# EAGLE design Teststand (EAGLE 8.5.2)
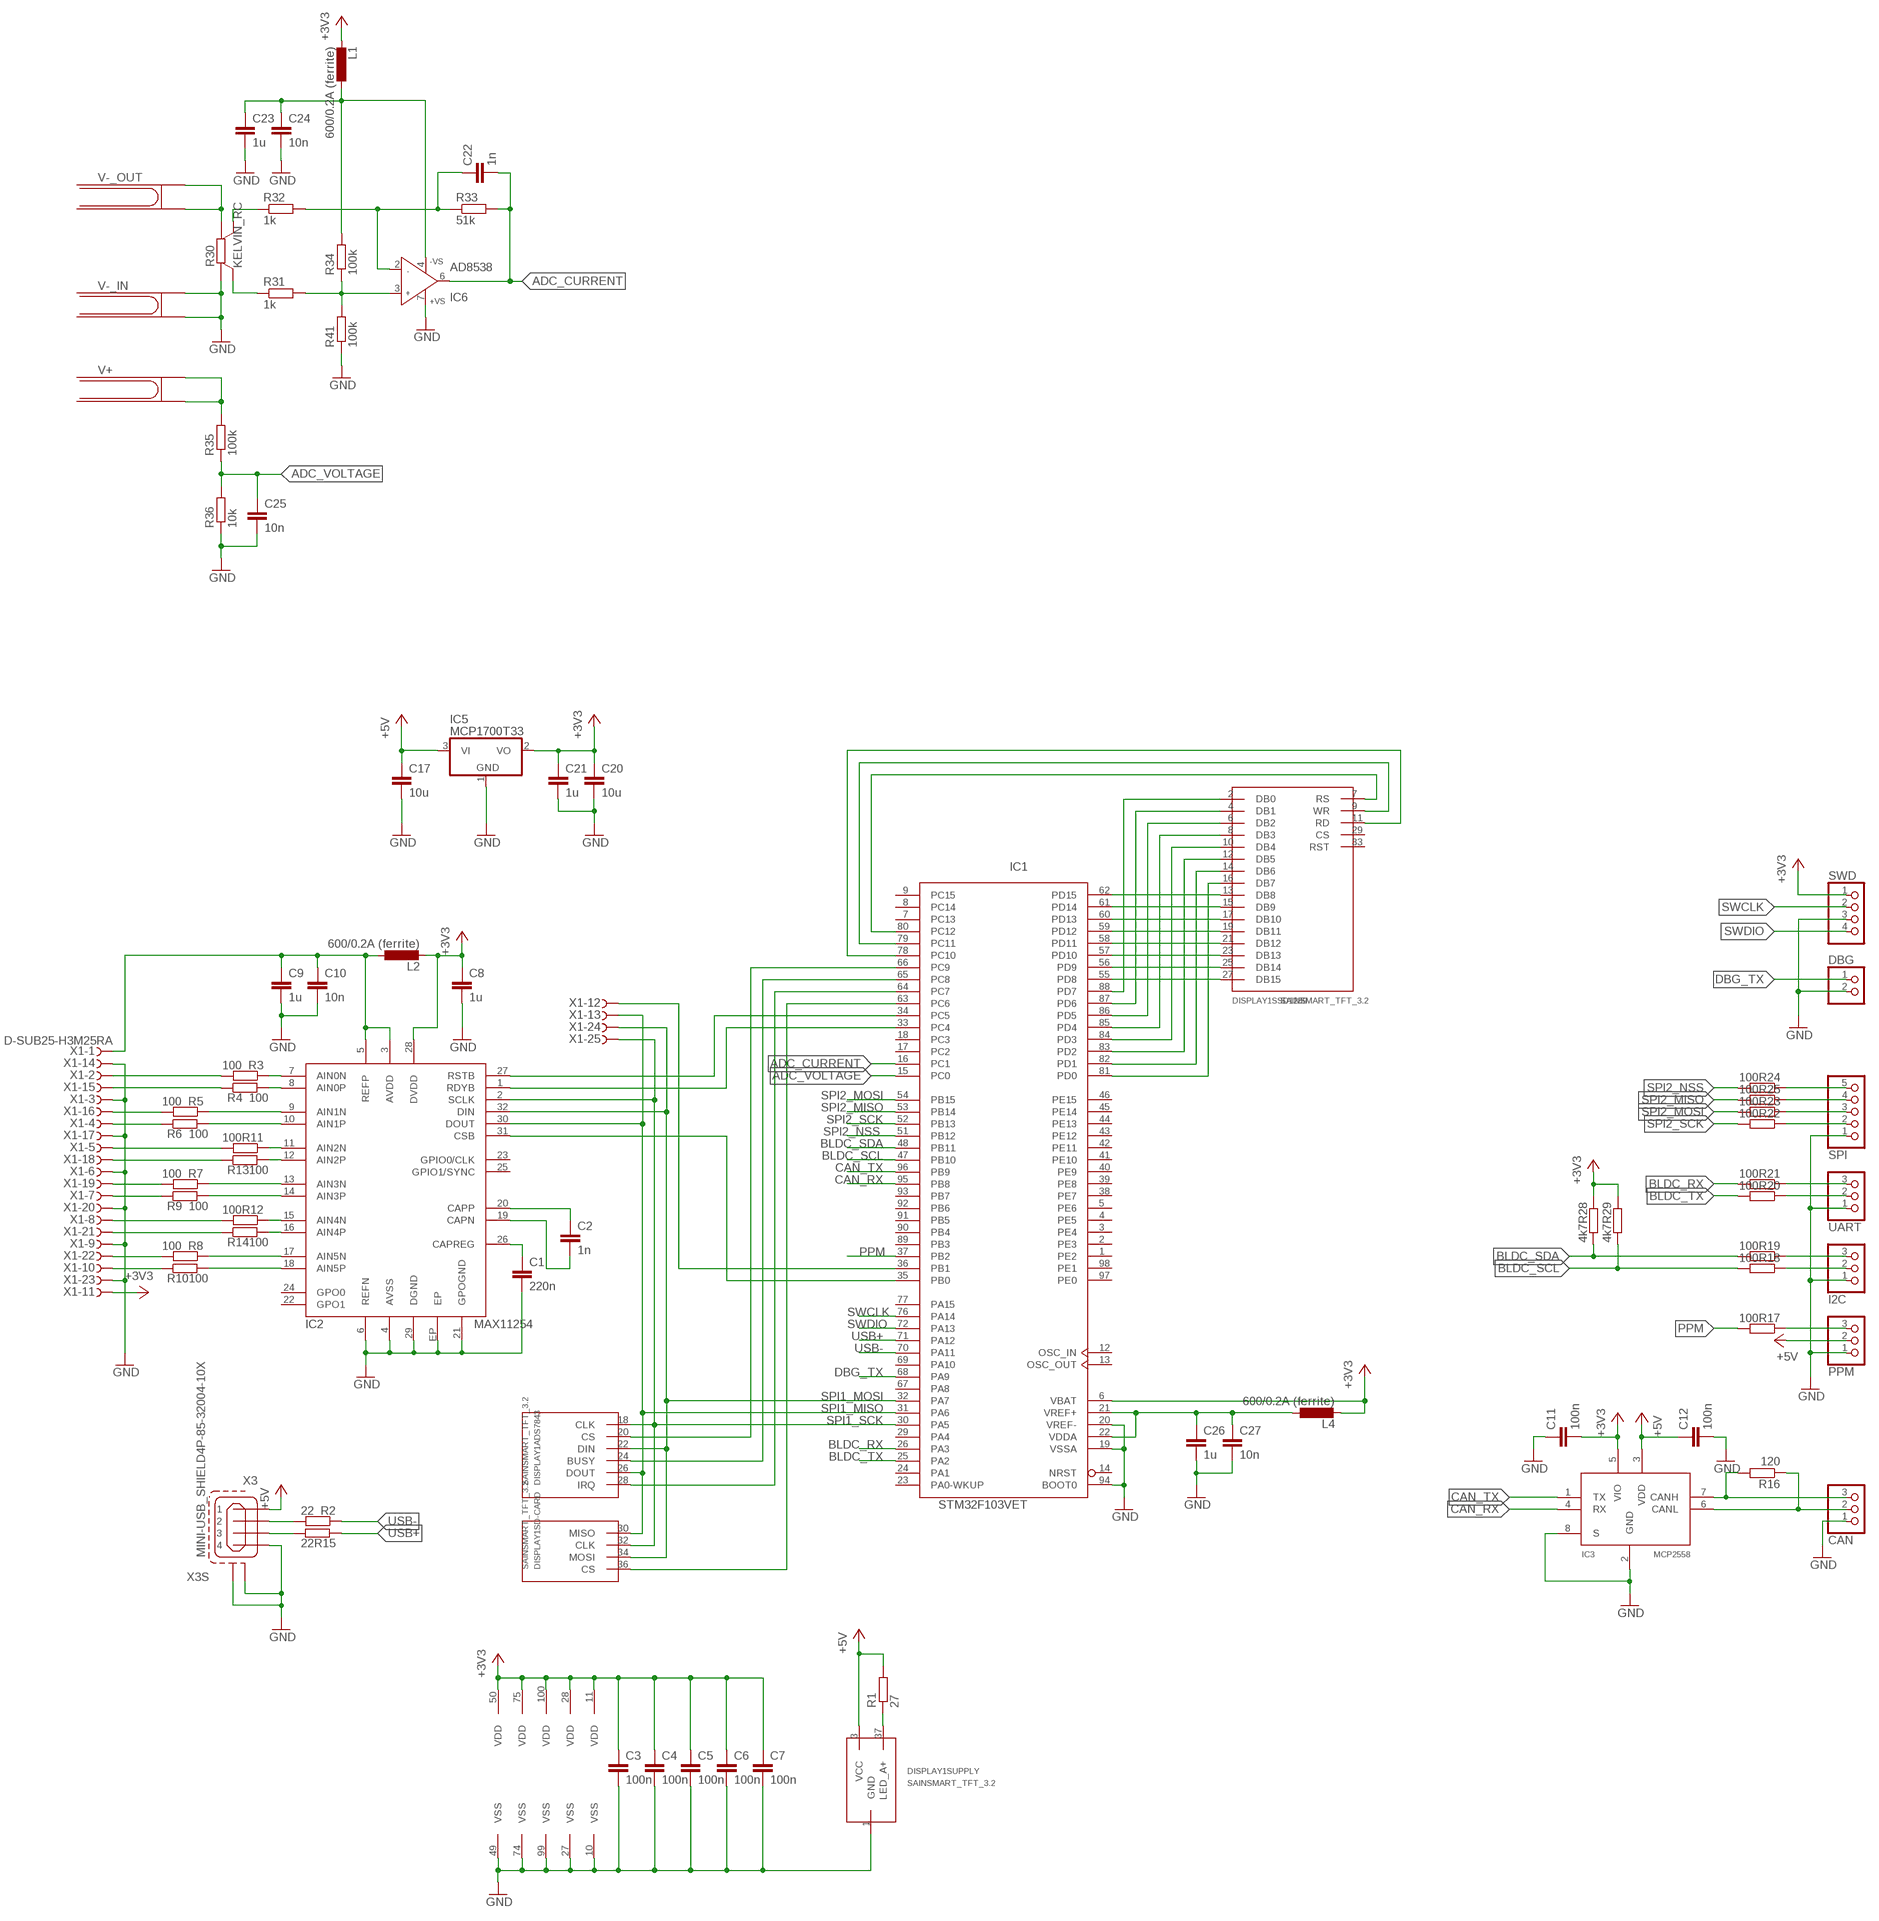
[diagram p0: schematic, sheet 1]

## Parts
C1  220n  C-EUC0603K  [C0603K]
C2  1n  C-EUC0603K  [C0603K]
C3  100n  C-EUC0603K  [C0603K]
C4  100n  C-EUC0603K  [C0603K]
C5  100n  C-EUC0603K  [C0603K]
C6  100n  C-EUC0603K  [C0603K]
C7  100n  C-EUC0603K  [C0603K]
C8  1u  C-EUC0603K  [C0603K]
C9  1u  C-EUC0603K  [C0603K]
C10  10n  C-EUC0603K  [C0603K]
C11  100n  C-EUC0603K  [C0603K]
C12  100n  C-EUC0603K  [C0603K]
C17  10u  C-EUC1206  [C1206]
C20  10u  C-EUC1206  [C1206]
C21  1u  C-EUC1206  [C1206]
C22  1n  C-EUC0603K  [C0603K]
C23  1u  C-EUC0603K  [C0603K]
C24  10n  C-EUC0603K  [C0603K]
C25  10n  C-EUC0603K  [C0603K]
C26  1u  C-EUC0603K  [C0603K]
C27  10n  C-EUC0603K  [C0603K]
CAN  PINHD-1X3/90  [1X03/90]
DBG  PINHD-1X2  [1X02]
DISPLAY1  SAINSMART_TFT_3.2  [SAINSMART_TFT_3.2]
I2C  PINHD-1X3/90  [1X03/90]
IC1  STM32F103VET  [LQFP100]
IC2  MAX11254  [TQFP32-EP]
IC3  MCP2558  [SOIC8]
IC5  MCP1700T33  MCP1703CB  [SOT23]
IC6  AD8538  AD8519R  [SO8]
L1  600/0.2A (ferrite)  L-EUL2012C  [L2012C]
L2  600/0.2A (ferrite)  L-EUL2012C  [L2012C]
L4  600/0.2A (ferrite)  L-EUL2012C  [L2012C]
PPM  PINHD-1X3/90  [1X03/90]
R1  27  R-EU_M1206  [M1206]
R2  22  R-EU_R0603  [R0603]
R3  100  R-EU_R0603  [R0603]
R4  100  R-EU_R0603  [R0603]
R5  100  R-EU_R0603  [R0603]
R6  100  R-EU_R0603  [R0603]
R7  100  R-EU_R0603  [R0603]
R8  100  R-EU_R0603  [R0603]
R9  100  R-EU_R0603  [R0603]
R10  100  R-EU_R0603  [R0603]
R11  100  R-EU_R0603  [R0603]
R12  100  R-EU_R0603  [R0603]
R13  100  R-EU_R0603  [R0603]
R14  100  R-EU_R0603  [R0603]
R15  22  R-EU_R0603  [R0603]
R16  120  R-EU_R0603  [R0603]
R17  100  R-EU_R0603  [R0603]
R18  100  R-EU_R0603  [R0603]
R19  100  R-EU_R0603  [R0603]
R20  100  R-EU_R0603  [R0603]
R21  100  R-EU_R0603  [R0603]
R22  100  R-EU_R0603  [R0603]
R23  100  R-EU_R0603  [R0603]
R24  100  R-EU_R0603  [R0603]
R25  100  R-EU_R0603  [R0603]
R28  4k7  R-EU_R0603  [R0603]
R29  4k7  R-EU_R0603  [R0603]
R30  KELVIN_RC  [CST0612]
R31  1k  R-EU_R0603  [R0603]
R32  1k  R-EU_R0603  [R0603]
R33  51k  R-EU_R0603  [R0603]
R34  100k  R-EU_R0603  [R0603]
R35  100k  R-EU_R0603  [R0603]
R36  10k  R-EU_R0603  [R0603]
R41  100k  R-EU_R0603  [R0603]
SPI  PINHD-1X5/90  [1X05/90]
SWD  PINHD-1X4  [1X04]
UART  PINHD-1X3/90  [1X03/90]
V+  4MMJACK  [4MMJACK]
V-_IN  4MMJACK  [4MMJACK]
V-_OUT  4MMJACK  [4MMJACK]
X1  D-SUB25-H3M25RA  [H3M25RA]
X3  MINI-USB_SHIELD4P-85-32004-10X  [85-32004-10X]

## Nets
+3V3: C3.1 C4.1 C5.1 C6.1 C7.1 C8.1 C11.2 C20.1 C21.1 IC1.6(VBAT) IC1.11(VDD) IC1.28(VDD) IC1.50(VDD) IC1.75(VDD) IC1.100(VDD) IC2.28(DVDD) IC3.5(VIO) IC5.2(VO) L1.2 L2.2 L4.2 R28.1 R29.1 SWD.1 X1.11
+5V: C12.1 C17.1 DISPLAY1.3(SUPPLY:VCC) IC3.3(VDD) IC5.3(VI) PPM.2 R1.2 X3.1
ADC_CURRENT: C22.2 IC1.16(PC1) IC6.6(OUT) R33.2
ADC_VOLTAGE: C25.1 IC1.15(PC0) R35.1 R36.2
BLDC_RX: IC1.26(PA3) R21.2
BLDC_SCL: IC1.47(PB10) R18.2 R29.2
BLDC_SDA: IC1.48(PB11) R19.2 R28.2
BLDC_TX: IC1.25(PA2) R20.2
CAN_RX: IC1.95(PB8) IC3.4(RX)
CAN_TX: IC1.96(PB9) IC3.1(TX)
DBG_TX: DBG.1 IC1.68(PA9)
GND: C1.2 C3.2 C4.2 C5.2 C6.2 C7.2 C8.2 C9.2 C10.2 C11.1 C12.2 C17.2 C20.2 C21.2 C23.2 C24.2 C25.2 C26.2 C27.2 CAN.1 DBG.2 DISPLAY1.1(SUPPLY:GND) I2C.1 IC1.10(VSS) IC1.19(VSSA) IC1.20(VREF-) IC1.27(VSS) IC1.49(VSS) IC1.74(VSS) IC1.94(BOOT0) IC1.99(VSS) IC2.4(AVSS) IC2.6(REFN) IC2.21(GPOGND) IC2.29(DGND) IC2.EP IC3.2(GND) IC3.8(S) IC5.1(GND) IC6.7(+VS) PPM.1 R30.B R36.1 R41.1 SPI.1 SWD.3 UART.1 V-_IN.1@1 V-_IN.1@2 X1.3 X1.6 X1.9 X1.14 X1.17 X1.20 X1.23 X3.4 X3.M1(S1) X3.M2(S2)
N$1: DISPLAY1.13(SSD1289:DB8) IC1.62(PD15)
N$2: DISPLAY1.15(SSD1289:DB9) IC1.61(PD14)
N$3: DISPLAY1.17(SSD1289:DB10) IC1.60(PD13)
N$4: DISPLAY1.19(SSD1289:DB11) IC1.59(PD12)
N$5: DISPLAY1.21(SSD1289:DB12) IC1.58(PD11)
N$6: DISPLAY1.23(SSD1289:DB13) IC1.57(PD10)
N$7: DISPLAY1.25(SSD1289:DB14) IC1.56(PD9)
N$8: DISPLAY1.27(SSD1289:DB15) IC1.55(PD8)
N$9: DISPLAY1.2(SSD1289:DB0) IC1.88(PD7)
N$10: DISPLAY1.4(SSD1289:DB1) IC1.87(PD6)
N$11: DISPLAY1.6(SSD1289:DB2) IC1.86(PD5)
N$12: DISPLAY1.8(SSD1289:DB3) IC1.85(PD4)
N$13: DISPLAY1.10(SSD1289:DB4) IC1.84(PD3)
N$14: DISPLAY1.12(SSD1289:DB5) IC1.83(PD2)
N$15: DISPLAY1.14(SSD1289:DB6) IC1.82(PD1)
N$16: DISPLAY1.16(SSD1289:DB7) IC1.81(PD0)
N$17: DISPLAY1.7(SSD1289:RS) IC1.80(PC12)
N$18: DISPLAY1.9(SSD1289:WR) IC1.79(PC11)
N$19: DISPLAY1.11(SSD1289:RD) IC1.78(PC10)
N$20: DISPLAY1.20(ADS7843:CS) IC1.66(PC9)
N$21: DISPLAY1.24(ADS7843:BUSY) IC1.65(PC8)
N$22: C1.1 IC2.26(CAPREG)
N$23: C2.1 IC2.20(CAPP)
N$24: C2.2 IC2.19(CAPN)
N$25: R3.2 X1.2
N$26: R4.1 X1.15
N$27: DISPLAY1.37(SUPPLY:LED_A+) R1.1
N$28: C9.1 C10.1 IC2.3(AVDD) IC2.5(REFP) L2.1 X1.1
N$29: IC2.9(AIN1N) R5.1
N$30: IC2.10(AIN1P) R6.2
N$31: R5.2 X1.16
N$32: R6.1 X1.4
N$33: IC2.13(AIN3N) R7.1
N$34: IC2.14(AIN3P) R9.2
N$35: R11.2 X1.5
N$36: R13.1 X1.18
N$37: IC2.17(AIN5N) R8.1
N$38: IC2.18(AIN5P) R10.2
N$39: R7.2 X1.19
N$40: R9.1 X1.7
N$41: R12.2 X1.8
N$42: R14.1 X1.21
N$43: IC2.15(AIN4N) R12.1
N$44: IC2.16(AIN4P) R14.2
N$45: IC2.12(AIN2P) R13.2
N$46: IC2.11(AIN2N) R11.1
N$47: R8.2 X1.22
N$48: R10.1 X1.10
N$49: IC2.8(AIN0P) R4.2
N$50: IC2.7(AIN0N) R3.1
N$51: R2.2 X3.2
N$52: R15.2 X3.3
N$53: CAN.3 IC3.7(CANH) R16.2
N$54: CAN.2 IC3.6(CANL) R16.1
N$55: IC1.34(PC5) IC2.27(RSTB)
N$56: R24.1 SPI.5
N$57: R25.1 SPI.4
N$58: R23.1 SPI.3
N$59: R22.1 SPI.2
N$60: R21.1 UART.3
N$61: R20.1 UART.2
N$62: I2C.3 R19.1
N$63: I2C.2 R18.1
N$64: PPM.3 R17.1
N$65: IC1.33(PC4) IC2.1(RDYB)
N$66: IC1.35(PB0) IC2.31(CSB)
N$67: DISPLAY1.28(ADS7843:IRQ) IC1.64(PC7)
N$68: DISPLAY1.36(SD-CARD:CS) IC1.63(PC6)
N$69: IC1.36(PB1) X1.12
N$70: R35.2 V+.1@1 V+.1@2
N$71: R30.A V-_OUT.1@1 V-_OUT.1@2
N$72: C26.1 C27.1 IC1.21(VREF+) IC1.22(VDDA) L4.1
N$73: C23.1 C24.1 IC6.4(-VS) L1.1 R34.2
N$74: R30.SA R32.1
N$75: C22.1 IC6.2(IN-) R32.2 R33.1
N$76: R30.SB R31.1
N$77: IC6.3(IN+) R31.2 R34.1 R41.2
PPM: IC1.37(PB2) R17.2
SPI1_MISO: DISPLAY1.26(ADS7843:DOUT) DISPLAY1.30(SD-CARD:MISO) IC1.31(PA6) IC2.30(DOUT) X1.13
SPI1_MOSI: DISPLAY1.22(ADS7843:DIN) DISPLAY1.34(SD-CARD:MOSI) IC1.32(PA7) IC2.32(DIN) X1.24
SPI1_SCK: DISPLAY1.18(ADS7843:CLK) DISPLAY1.32(SD-CARD:CLK) IC1.30(PA5) IC2.2(SCLK) X1.25
SPI2_MISO: IC1.53(PB14) R25.2
SPI2_MOSI: IC1.54(PB15) R23.2
SPI2_NSS: IC1.51(PB12) R24.2
SPI2_SCK: IC1.52(PB13) R22.2
SWCLK: IC1.76(PA14) SWD.2
SWDIO: IC1.72(PA13) SWD.4
USB+: IC1.71(PA12) R15.1
USB-: IC1.70(PA11) R2.1
Unconnected: DISPLAY1.29(SSD1289:CS) DISPLAY1.33(SSD1289:RST) IC1.1(PE2) IC1.2(PE3) IC1.3(PE4) IC1.4(PE5) IC1.5(PE6) IC1.7(PC13) IC1.8(PC14) IC1.9(PC15) IC1.12(OSC_IN) IC1.13(OSC_OUT) IC1.14(NRST) IC1.17(PC2) IC1.18(PC3) IC1.23(PA0-WKUP) IC1.24(PA1) IC1.29(PA4) IC1.38(PE7) IC1.39(PE8) IC1.40(PE9) IC1.41(PE10) IC1.42(PE11) IC1.43(PE12) IC1.44(PE13) IC1.45(PE14) IC1.46(PE15) IC1.67(PA8) IC1.69(PA10) IC1.77(PA15) IC1.89(PB3) IC1.90(PB4) IC1.91(PB5) IC1.92(PB6) IC1.93(PB7) IC1.97(PE0) IC1.98(PE1) IC2.22(GPO1) IC2.23(GPIO0/CLK) IC2.24(GPO0) IC2.25(GPIO1/SYNC)

## Library data of the parts
C1-C12 C17 C20-C27 = rcl:C-EU: CAPACITOR, European symbol; SPICEPREFIX: C
CAN I2C PPM UART = pinhead:PINHD-1X3: PIN HEADER
DBG = pinhead:PINHD-1X2: PIN HEADER
DISPLAY1 = sainsmart:SAINSMART_TFT_3.2
IC1 = micro-stm:STM32F103V*T: ARM 32-bit Cortex™-M3 CPU 72 MHz maximum frequency 64 to 1028 Kbytes of Flash memory 20 to 96 kbytes of SRAM 80 GPIOs 2.0 to 3.6 V application supply
IC2 = custom-ic:MAX11254
IC3 = custom-ic:MCP2558
IC5 = linear:MCP1703: 250 mA, 16V, Low Quiescent Current LDO Regulator Source: http://ww1.microchip.com/downloads/en/DeviceDoc/22049b.pdf
IC6 = analog-devices:AD8519: 8 MHz Rail-to-Rail Operational Amplifiers Source: http://www.analog.com/static/imported-files/data_sheets/AD8519_8529.pdf; MPN: AD8519ARZ; OC_FARNELL: 9603840; OC_NEWARK: 19M8912
L1 L2 L4 = rcl:L-EU: INDUCTOR, European symbol
R1-R25 R28 R29 R31-R36 R41 = rcl:R-EU_: RESISTOR, European symbol; SPICEPREFIX: R
R30 = custom-lcr:KELVIN_R
SPI = pinhead:PINHD-1X5: PIN HEADER
SWD = pinhead:PINHD-1X4: PIN HEADER
V+ V-_IN V-_OUT = dmm:4MMJACK
X1 = con-thomas-betts:D-SUB25-: D-Subminiatur Connector Source: Electronioc Interconnects European Edition 1998; OC_FARNELL: unknown; OC_NEWARK: unknown
X3 = con-cypressindustries:MINI-USB_SHIELD4P-: MINI USB 4 Pol. Source: www.cypressindustries.com; OC_FARNELL: unknown; OC_NEWARK: unknown

## Board
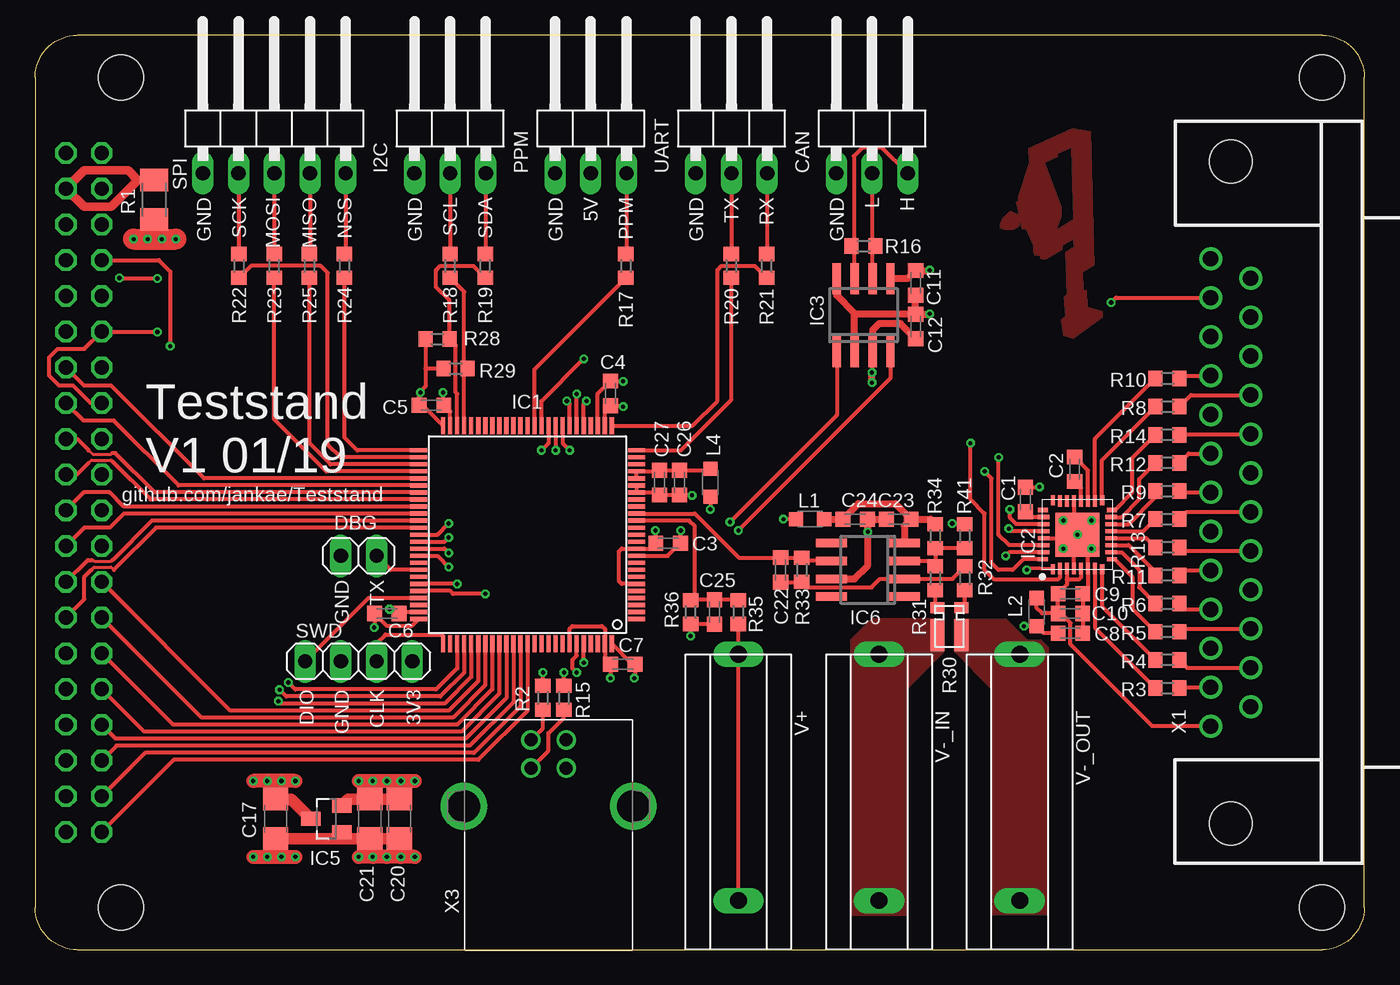
[diagram p1: board, top side]
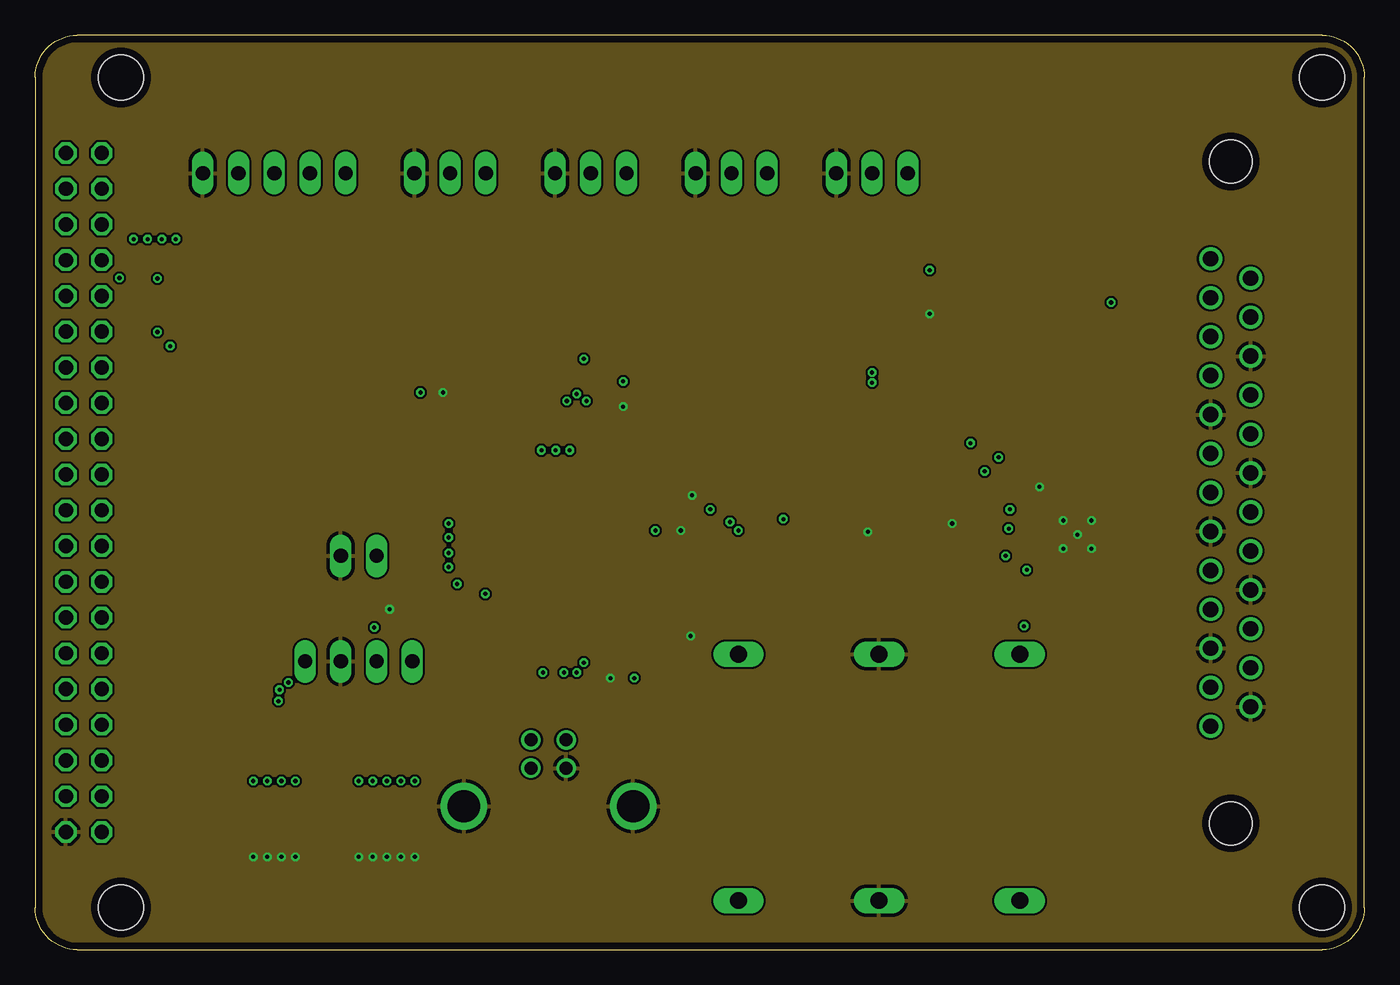
[diagram p2: board, inner layer Route2]
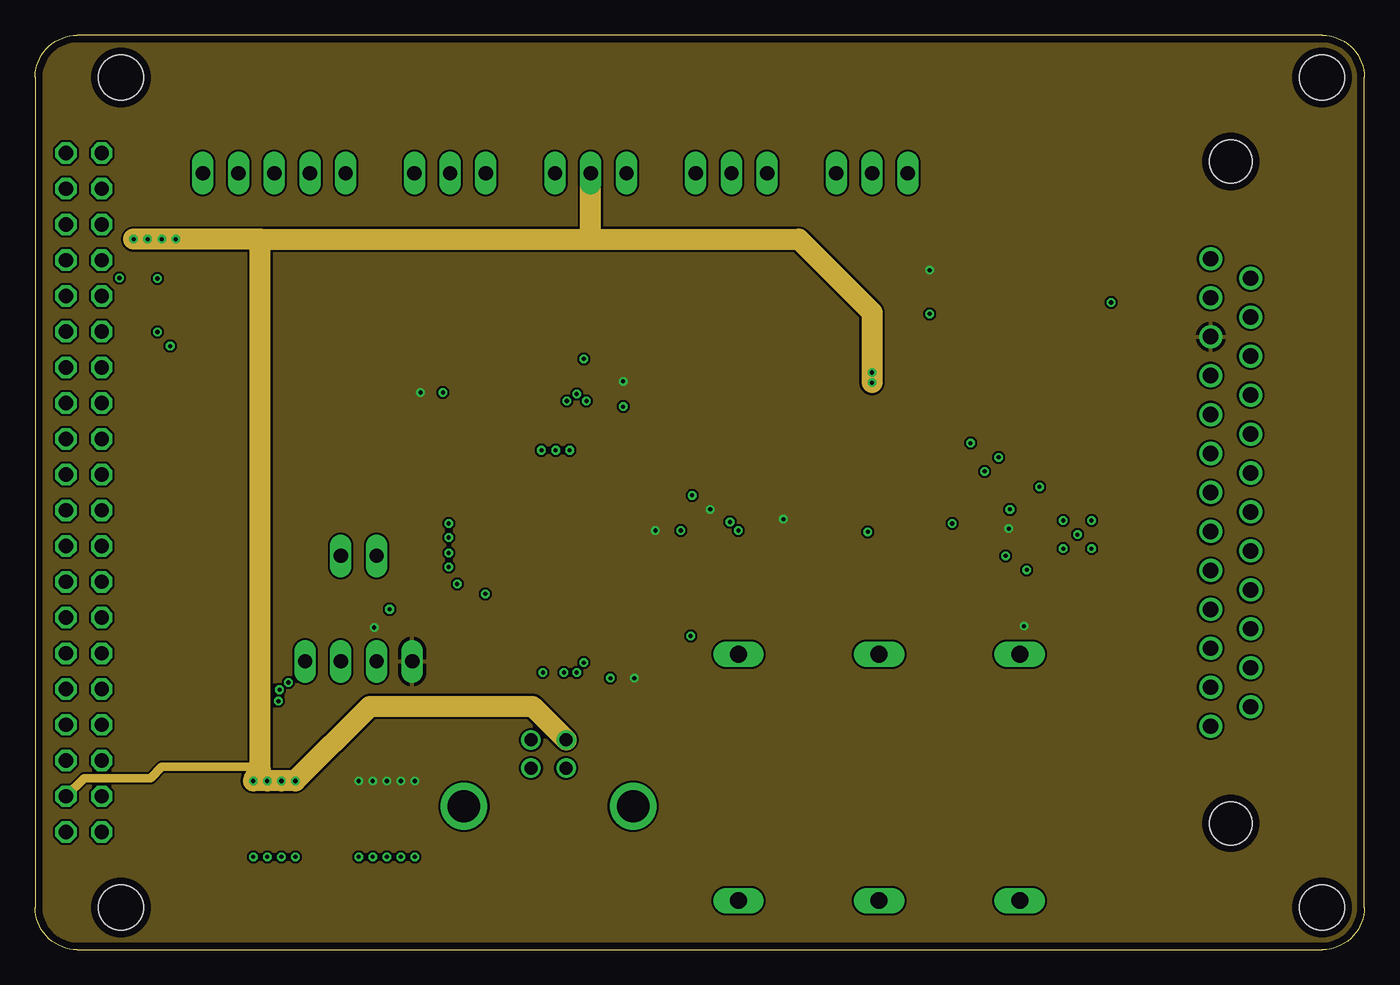
[diagram p3: board, inner layer Route15]
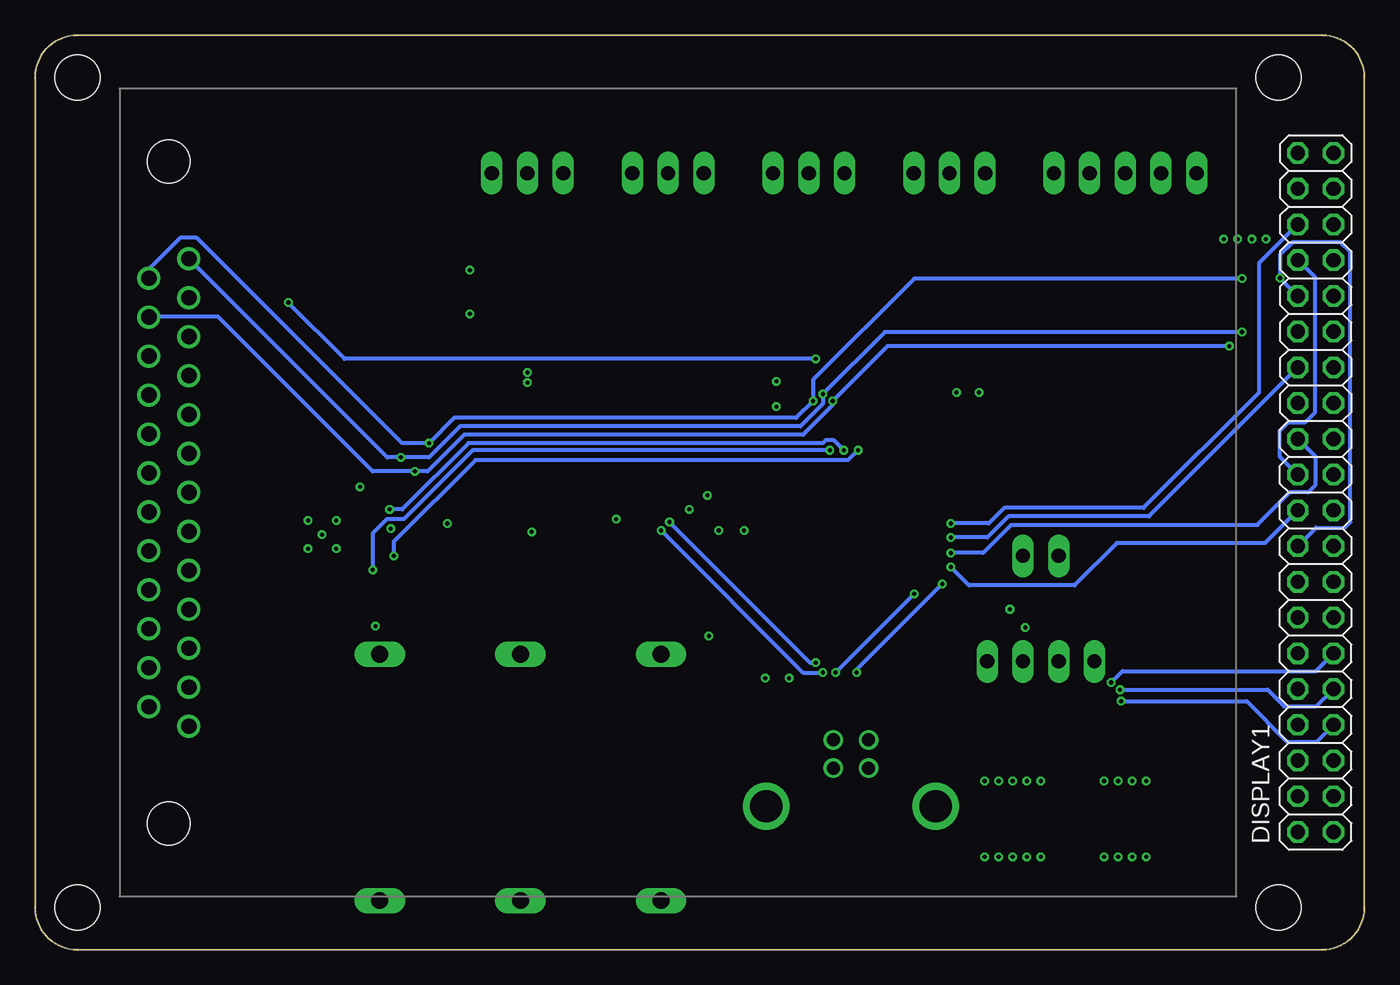
[diagram p4: board, bottom side, seen from below]

Size 94.5 x 65 mm. Coordinates in mm from the lower left corner, seen from the top.
Outline: 3,0 91.5,0 arc90 94.5,3 94.5,62 arc90 91.5,65 3,65 arc90 0,62 0,3 arc90 3,0
Copper layers (1*2*15*16): Top 0.035mm / dielectric 0.2mm / Route2 0.035mm / dielectric 1.2mm / Route15 0.035mm / dielectric 0.2mm / Bottom 0.035mm
Design rules "Elecrow_4-layer_PCB_eagle_rule *": minimum track width 6mil, minimum drill 0.3mm, track to track 6mil, track to pad 6mil, pad to pad 6mil, via to via 8mil, smd to smd 0mil, copper to edge 20mil, drill to drill 10mil, minimum pad ring 6mil, minimum via ring 6mil, stop-mask expansion 0mil, vias tented up to drill 100mil, thermal gap 10mil
Holes 3.2 mm at 6.1,62 91.5,62 91.5,3 6.1,3
tRestrict: area 71.8,51.3 to 73.8,57

### Footprints (pad centres in the part's own frame; a part is rotated, then mirrored left to right if it is on the bottom)
C0603K = smd 1.05 x 1.08: 1 -0.875,0; 2 0.875,0
C1206 = smd 1.6 x 1.8: 1 -1.4,0; 2 1.4,0
1X03/90 = drill 1.016 long: 1 -2.54,-3.81; 2 0,-3.81; 3 2.54,-3.81
1X02 = drill 1.016 long: 1 -1.27,0; 2 1.27,0
SAINSMART_TFT_3.2 = drill 1.016 octagon: 1 2.19,56.63; 2 4.73,56.63; 3 2.19,54.09; 4 4.73,54.09; 5 2.19,51.55; 6 4.73,51.55; 7 2.19,49.01; 8 4.73,49.01; 9 2.19,46.47; 10 4.73,46.47; 11 2.19,43.93; 12 4.73,43.93; 13 2.19,41.39; 14 4.73,41.39; 15 2.19,38.85; 16 4.73,38.85; 17 2.19,36.31; 18 4.73,36.31; 19 2.19,33.77; 20 4.73,33.77; 21 2.19,31.23; 22 4.73,31.23; 23 2.19,28.69; 24 4.73,28.69; 25 2.19,26.15; 26 4.73,26.15; 27 2.19,23.61; 28 4.73,23.61; 29 2.19,21.07; 30 4.73,21.07; 31 2.19,18.53; 32 4.73,18.53; 33 2.19,15.99; 34 4.73,15.99; 35 2.19,13.45; 36 4.73,13.45; 37 2.19,10.91; 38 4.73,10.91; 39 2.19,8.37; 40 4.73,8.37
LQFP100 = smd 0.3 x 1.2: 1 -6,-7.75; 2 -5.5,-7.75; 3 -5,-7.75; 4 -4.5,-7.75; 5 -4,-7.75; 6 -3.5,-7.75; 7 -3,-7.75; 8 -2.5,-7.75; 9 -2,-7.75; 10 -1.5,-7.75; 11 -1,-7.75; 12 -0.5,-7.75; 13 0,-7.75; 14 0.5,-7.75; 15 1,-7.75; 16 1.5,-7.75; 17 2,-7.75; 18 2.5,-7.75; 19 3,-7.75; 20 3.5,-7.75; 21 4,-7.75; 22 4.5,-7.75; 23 5,-7.75; 24 5.5,-7.75; 25 6,-7.75; 51 6,7.75; 52 5.5,7.75; 53 5,7.75; 54 4.5,7.75; 55 4,7.75; 56 3.5,7.75; 57 3,7.75; 58 2.5,7.75; 59 2,7.75; 60 1.5,7.75; 61 1,7.75; 62 0.5,7.75; 63 0,7.75; 64 -0.5,7.75; 65 -1,7.75; 66 -1.5,7.75; 67 -2,7.75; 68 -2.5,7.75; 69 -3,7.75; 70 -3.5,7.75; 71 -4,7.75; 72 -4.5,7.75; 73 -5,7.75; 74 -5.5,7.75; 75 -6,7.75 | smd 1.2 x 0.3: 26 7.75,-6; 27 7.75,-5.5; 28 7.75,-5; 29 7.75,-4.5; 30 7.75,-4; 31 7.75,-3.5; 32 7.75,-3; 33 7.75,-2.5; 34 7.75,-2; 35 7.75,-1.5; 36 7.75,-1; 37 7.75,-0.5; 38 7.75,0; 39 7.75,0.5; 40 7.75,1; 41 7.75,1.5; 42 7.75,2; 43 7.75,2.5; 44 7.75,3; 45 7.75,3.5; 46 7.75,4; 47 7.75,4.5; 48 7.75,5; 49 7.75,5.5; 50 7.75,6; 76 -7.75,6; 77 -7.75,5.5; 78 -7.75,5; 79 -7.75,4.5; 80 -7.75,4; 81 -7.75,3.5; 82 -7.75,3; 83 -7.75,2.5; 84 -7.75,2; 85 -7.75,1.5; 86 -7.75,1; 87 -7.75,0.5; 88 -7.75,0; 89 -7.75,-0.5; 90 -7.75,-1; 91 -7.75,-1.5; 92 -7.75,-2; 93 -7.75,-2.5; 94 -7.75,-3; 95 -7.75,-3.5; 96 -7.75,-4; 97 -7.75,-4.5; 98 -7.75,-5; 99 -7.75,-5.5; 100 -7.75,-6
TQFP32-EP = smd 0.7 x 0.3: 1 -2.45,1.75; 8 -2.45,-1.75; 17 2.45,-1.75; 24 2.45,1.75 | smd 0.8 x 0.3: 2 -2.4,1.25; 3 -2.4,0.75; 4 -2.4,0.25; 5 -2.4,-0.25; 6 -2.4,-0.75; 7 -2.4,-1.25; 18 2.4,-1.25; 19 2.4,-0.75; 20 2.4,-0.25; 21 2.4,0.25; 22 2.4,0.75; 23 2.4,1.25 | smd 0.3 x 0.7: 9 -1.75,-2.45; 16 1.75,-2.45; 25 1.75,2.45; 32 -1.75,2.45 | smd 0.3 x 0.8: 10 -1.25,-2.4; 11 -0.75,-2.4; 12 -0.25,-2.4; 13 0.25,-2.4; 14 0.75,-2.4; 15 1.25,-2.4; 26 1.25,2.4; 27 0.75,2.4; 28 0.25,2.4; 29 -0.25,2.4; 30 -0.75,2.4; 31 -1.25,2.4 | smd 3.15 x 3.15: EP 0,0
SOIC8 = smd 0.6 x 2.2: 1 -1.905,-2.6; 2 -0.635,-2.6; 3 0.635,-2.6; 4 1.905,-2.6; 5 1.905,2.6; 6 0.635,2.6; 7 -0.635,2.6; 8 -1.905,2.6
SOT23 = smd 1 x 1.4: 1 -0.95,-1.1; 2 0.95,-1.1; 3 0,1.1
SO8 = smd 0.6 x 2.2: 1 -1.905,-2.6; 2 -0.635,-2.6; 3 0.635,-2.6; 4 1.905,-2.6; 5 1.905,2.6; 6 0.635,2.6; 7 -0.635,2.6; 8 -1.905,2.6
L2012C = smd 1 x 1: 1 -1,0; 2 1,0
M1206 = smd 1.6 x 2: 1 -1.4,0; 2 1.4,0
R0603 = smd 1 x 1.1: 1 -0.85,0; 2 0.85,0
CST0612 = smd 1 x 2.3: A -0.85,1.15; B 0.85,1.15 | smd 1 x 0.8: SA -0.85,-0.8; SB 0.85,-0.8
1X05/90 = drill 1.016 long: 1 -5.08,-3.81; 2 -2.54,-3.81; 3 0,-3.81; 4 2.54,-3.81; 5 5.08,-3.81
1X04 = drill 1.016 long: 1 -3.81,0; 2 -1.27,0; 3 1.27,0; 4 3.81,0
4MMJACK = drill 1.2 long: 1@1 0,0; 1@2 17.5,0
H3M25RA = drill 1.092: 1 -16.612,1.422; 2 -13.843,1.422; 3 -11.074,1.422; 4 -8.306,1.422; 5 -5.537,1.422; 6 -2.769,1.422; 7 0,1.422; 8 2.769,1.422; 9 5.537,1.422; 10 8.306,1.422; 11 11.074,1.422; 12 13.843,1.422; 13 16.612,1.422; 14 -15.227,-1.422; 15 -12.459,-1.422; 16 -9.69,-1.422; 17 -6.921,-1.422; 18 -4.153,-1.422; 19 -1.384,-1.422; 20 1.384,-1.422; 21 4.153,-1.422; 22 6.921,-1.422; 23 9.69,-1.422; 24 12.459,-1.422; 25 15.227,-1.422 | hole 3.048: -23.52,0; 23.52,0
85-32004-10X = drill 0.92 pad 1.27: 1 4.71,-1.25; 2 4.71,1.25; 3 2.71,1.25; 4 2.71,-1.25 | drill 2.3 pad 3: M1 0,6.02; M2 0,-6.02

### Placement (x,y rotation side)
C1  70.4,32 90 top
C2  73.9,34.15 90 top
C3  45,28.9 0 top
C4  40.9,39.54 270 top
C5  28.18,38.7 0 top
C6  25,23.9 0 top
C7  41.78,20.3 180 top
C8  73.6,22.5 0 top
C9  73.6,25.3 0 top
C10  73.6,23.9 0 top
C11  62.6,47.4 90 top
C12  62.6,44.3 90 top
C17  17.1,9.3 270 top
C20  25.9,9.3 270 top
C21  23.8,9.3 270 top
C22  53,27 90 top
C23  61.4,30.6 180 top
C24  58.3,30.6 0 top
C25  48.3,24 270 top
C26  45.8,33.2 270 top
C27  44.4,33.2 270 top
CAN  59.5,59 0 top
DBG  23,28 180 top
DISPLAY1  0,65 180 bottom
I2C  29.5,59 0 top
IC1  35,29.5 90 top
IC2  74.1,29.5 90 top
IC3  58.9,45.1 0 top
IC5  20.7,9.3 90 top
IC6  59.2,27 90 top
L1  55.1,30.6 180 top
L2  71.2,24 270 top
L4  48,33.2 270 top
PPM  39.5,59 0 top
R1  8.47,53.3 270 top
R2  36.1,17.9 270 top
R3  80.5,18.6 0 top
R4  80.5,20.6 180 top
R5  80.5,22.6 0 top
R6  80.5,24.6 180 top
R7  80.5,30.6 0 top
R8  80.5,38.6 0 top
R9  80.5,32.6 180 top
R10  80.5,40.6 180 top
R11  80.5,26.6 0 top
R12  80.5,34.6 0 top
R13  80.5,28.6 180 top
R14  80.5,36.6 180 top
R15  37.6,17.9 270 top
R16  58.9,50 180 top
R17  42,48.6 270 top
R18  29.5,48.6 270 top
R19  32,48.6 270 top
R20  49.5,48.6 270 top
R21  52,48.6 270 top
R22  14.5,48.6 270 top
R23  17,48.6 270 top
R24  22,48.6 270 top
R25  19.5,48.6 270 top
R28  28.6,43.4 0 top
R29  29.9,41.3 0 top
R30  65,23.5 180 top
R31  64,26.4 90 top
R32  66.1,26.4 90 top
R33  54.5,27 90 top
R34  64,29.4 90 top
R35  50,24 270 top
R36  46.6,24 90 top
R41  66.1,29.4 270 top
SPI  17,59 0 top
SWD  23,20.5 180 top
UART  49.5,59 0 top
V+  50,21 270 top
V-_IN  60,21 270 top
V-_OUT  70,21 270 top
X1  85,32.5 90 top
X3  36.5,10.2 90 top

### Tracks (layer width: path | path; a pad name or v marks a point on that pad's centre or on a via)
+3V3  (via drill 0.3)
  Top 0.3: C8.1 71.7,22.5 L2.2 v70.3,23 | IC1.100 42.45,20.3 C7.1 42.66,19.3 v42.6,19.3 | IC1.75 26.75,23 25.02,23 C6.1 24.12,22.93 v24.1,22.9 | IC1.50 27.55,38.7 C5.1 27.3,39.6 | IC1.28 40,39.52 C4.1 v41.8,40.4 | 27.3,39.6 v27.4,39.6 | v44.1,29.8 44.12,29.8 C3.1 43.73,28.5 IC1.11 41.7,28.5 41.5,28.3 41.5,26.2 41.7,26 IC1.6 | R28.1 27.75,41.3 | 27.75,41.3 27.75,40.05 27.3,39.6 | R29.1 27.75,41.3 | L4.2 v48,31.3 | L1.2 v53.2,30.6 | IC2.28 69.39,29.75 v69.22,29.92
  Top 0.5: IC3.5 62.02,47.7 C11.2 63.58,48.27 v63.6,48.3
  Top 0.8: C20.1 C21.1 22.25,10.7 IC5.2
  Top 1: v23,12 v24,12 v25,12 v26,12 | v26,12 v27,12 | C20.1 25.9,11.9 v26,12
  pour Route15: -2.5,69.2 98.9,69.2 98.9,-4.7 -2.5,-4.7
+5V  (via drill 0.3)
  Top 0.3: IC3.3 59.5,42.47 v59.5,41.02
  Top 0.5: v59.5,40.3 v59.5,41.02 | C12.1 61.52,44.5 60,44.5 59.53,44.03 IC3.3
  Top 0.8: C17.1 18.2,10.7 IC5.3
  Top 1: C17.1 17.1,11.6 v17.5,12 | v18.5,12 v15.5,12
  Top 1.5: v7,50.5 v8,50.5 | v8,50.5 v10,50.5 | R1.2 8.47,50.97 | 8.47,50.97 v8,50.5 | v9,50.5 8.94,50.5 8.47,50.97
  Route15 0.6: DISPLAY1.3 3.48,12.2 8.2,12.2 9,13 15.8,13 16,12.8
  Route15 1.5: 16,50.5 16,12.8 v15.5,12 v16.5,12 v17.5,12 v18.5,12 23.8,17.3 35.36,17.3 X3.1 | 16,50.5 v7,50.5 | 16,50.5 39.5,50.5 | 39.5,50.5 PPM.2 | 39.5,50.5 54.3,50.5 59.5,45.3 v59.5,41.02 v59.5,40.3
ADC_CURRENT
  Top 0.3: IC1.16 46.9,31 50.02,27.88 C22.2 53.02,27.85 54.3,27.85 | 54.3,27.85 R33.2 | IC6.6 54.52,27.64 54.3,27.85
ADC_VOLTAGE
  Top 0.3: R35.1 49.98,24.88 C25.1 46.62,24.88 R36.2 46.9,25.15 46.9,30.1 46.5,30.5 IC1.15
BLDC_RX
  Top 0.3: IC1.26 46.75,37.25 48.5,39 48.5,48.3 48.8,48.6 51.15,48.6 R21.2
BLDC_SCL
  Top 0.3: IC1.47 30.5,41.2 | 30.5,41.2 30.5,46.75 R18.2 | R29.2 30.6,41.3 30.5,41.2
BLDC_SDA
  Top 0.3: IC1.48 30,39.5 29.9,39.6 29.9,42.95 R28.2 29.45,46.15 28.5,47.1 28.5,48.3 28.8,48.6 31.15,48.6 R19.2
BLDC_TX
  Top 0.3: IC1.25 45.9,35.5 49.5,39.1 R20.2
CAN_RX  (via drill 0.3)
  Top 0.3: IC3.4 60.8,40.6 v50,29.8 | v38.5,19.7 38.2,20 38.2,20.6 38.5,20.9 IC1.95
  Bottom 0.3: v50,29.8 39.9,19.7 v38.5,19.7
CAN_TX  (via drill 0.3)
  Top 0.3: IC3.1 56.99,37.99 v49.4,30.4 | v39,20.4 IC1.96
  Bottom 0.3: v49.4,30.4 39.4,20.4 v39,20.4
DBG_TX
  Top 0.3: IC1.68 25.27,27 DBG.1
GND  (via drill 0.3)
  Top 0.3: IC2.EP 74.85,28.75 IC2.6 74.85,25.68 C9.2 C10.2 C8.2 | IC2.4 73.85,29.25 IC2.EP | IC2.21 73.85,29.75 73.95,29.65 | 73.95,29.65 IC2.EP | IC2.29 73.55,29.25 73.95,29.65 | IC1.10 44.98,28 C3.2 45.88,29.8 v45.9,29.8 | IC1.74 25.98,24 C6.2 25.5,23.9 v25.2,24.2 | IC1.49 29.5,38.26 C5.2 29.05,39.6 v29,39.6 | IC1.27 40.5,38.27 C4.2 41.8,38.66 v41.8,38.6 | v40.9,19.3 v40.91,19.3 C7.2 40.5,20.7 IC1.99 40.5,22.8 40.3,23 38.2,23 38,22.8 IC1.94 | IC1.20 IC1.19 44.23,32.5 C27.2 C26.2 46.67,32.33 v46.7,32.3 | R41.1 65.25,30.25 v65.2,30.3 | C25.2 46.62,23.12 R36.1 v46.6,22.3 | C1.2 71.38,32.88 v71.4,32.9
  Top 0.5: IC6.7 58.27,26.36 59.2,27.3 v59.2,29.7 59.2,30.57 C24.2 C23.2 | C12.2 C11.1 | C12.2 63.58,45.17 v63.6,45.2 | C12.2 58.33,45.17 58.27,45.23 | IC3.2 58.27,45.23 | IC3.8 56.99,46.51 58.27,45.23
  Top 0.8: C20.2 C21.2 21.8,7.9 | 21.8,7.9 C17.2 | IC5.1 21.8,7.9
  Top 1: v27,6.6 v26,6.6 | v26,6.6 v25,6.6 v24,6.6 v23,6.6 | C20.2 25.9,6.7 v26,6.6 | v15.5,6.6 v16.5,6.6 v17.5,6.6 v18.5,6.6
  other vias: 73.1,30.5 73.1,28.5 74.1,29.5 75.1,28.5 75.1,30.5
  pour Route2: -1.9,67.9 97.7,67.9 97.7,-4.2 -1.9,-4.2
  pour Top (no thermals): 64.6,21.2 64.6,23.5 59.5,23.5 58,22 58,2.5 62,2.5 62,18.6
N$1
  Top 0.2: 4,27 4.2,27.2 5.4,27.2 5.6,27
  Top 0.3: DISPLAY1.13 3.5,24.92 3.5,26.5 4,27 | 5.6,27 8.6,30 IC1.62
N$2
  Top 0.2: 4,27.7 4.1,27.7 4.2,27.6 5.4,27.6 5.5,27.7
  Top 0.3: DISPLAY1.15 3.74,27.7 4,27.7 | 5.5,27.7 8.3,30.5 IC1.61
N$3
  Top 0.3: DISPLAY1.17 3.5,30 5.3,30 6.3,31 IC1.60
N$4
  Top 0.3: DISPLAY1.19 3.46,32.5 5.3,32.5 6.3,31.5 IC1.59
N$5
  Top 0.2: 3.8,34.6 4,34.8 5.4,34.8 5.5,34.7
  Top 0.3: DISPLAY1.21 2.97,33.77 3.8,34.6 | IC1.58 8.2,32 5.5,34.7
N$6
  Top 0.2: 3.8,35.5 4.1,35.2 5.4,35.2 5.5,35.3
  Top 0.3: DISPLAY1.23 2.99,36.31 3.8,35.5 | 5.5,35.3 5.7,35.3 8.5,32.5 IC1.57
N$7
  Top 0.3: DISPLAY1.25 3.44,37.6 5.6,37.6 10.2,33 IC1.56
N$8
  Top 0.3: DISPLAY1.27 3.48,40.1 5.4,40.1 12,33.5 IC1.55
N$9
  Top 0.3: IC1.88 35,17 31.5,13.5 9.86,13.5 DISPLAY1.2
N$10
  Top 0.3: IC1.87 34.5,17.3 31.2,14 7.82,14 DISPLAY1.4
N$11
  Top 0.3: IC1.86 34,17.6 30.9,14.5 5.78,14.5 DISPLAY1.6
N$12
  Top 0.3: IC1.85 33.5,17.9 30.6,15 5.72,15 DISPLAY1.8
N$13
  Top 0.3: IC1.84 33,18.2 30.3,15.5 7.76,15.5 DISPLAY1.10
N$14
  Top 0.3: IC1.83 32.5,18.5 30,16 9.8,16 DISPLAY1.12
N$15
  Top 0.3: IC1.82 32,18.8 29.7,16.5 11.84,16.5 DISPLAY1.14
N$16
  Top 0.3: IC1.81 31.5,19.1 29.4,17 13.88,17 DISPLAY1.16
N$17  (via drill 0.3)
  Top 0.3: IC1.80 31,19.4 29.1,17.5 17.47,17.5 v17.3,17.67
  Bottom 0.3: v17.3,17.67 8.37,17.67 5.5,14.8 3.38,14.8 DISPLAY1.7
N$18  (via drill 0.3)
  Top 0.3: IC1.79 30.5,19.7 28.8,18 17.86,18 v17.38,18.48
  Bottom 0.3: v17.38,18.48 6.88,18.48 5.7,17.3 3.42,17.3 DISPLAY1.9
N$19  (via drill 0.3)
  Top 0.3: IC1.78 30,20 28.5,18.5 18.5,18.5 v18,19
  Bottom 0.3: v18,19 17.2,19.8 3.46,19.8 DISPLAY1.11
N$20  (via drill 0.3)
  Top 0.3: IC1.66 28.6,28 v29.4,27.2
  Bottom 0.3: DISPLAY1.20 7.06,28.9 17.6,28.9 20.6,25.9 28.1,25.9 v29.4,27.2
N$21  (via drill 0.3)
  Top 0.3: IC1.65 29.1,28.5 v29.4,28.2
  Bottom 0.3: DISPLAY1.24 3.5,35.08 3.5,33 4,32.5 5.3,32.5 7.6,30.2 25.1,30.2 27.1,28.2 v29.4,28.2
N$22
  Top 0.3: IC2.26 70.78,30.75 C1.1
N$23
  Top 0.3: IC2.20 74.35,32.83 C2.1
N$24
  Top 0.3: IC2.19 74.85,34.08 C2.2
N$25
  Top 0.3: R3.2 81.41,18.66 X1.2
N$26
  Top 0.3: R4.1 81.91,20.04 X1.15
N$27
  Top 0.6: 7.3,54.7 6.6,55.4 3.5,55.4 DISPLAY1.37 3.48,52.8 5.4,52.8 7.3,54.7 | 7.3,54.7 R1.1
N$28
  Top 0.3: IC2.5 74.35,26.45 74.2,26.3 73.35,26.3 | IC2.3 73.35,26.3 | 73.35,26.3 73.35,25.93 C9.1 72.72,24.1 | 72.72,24.1 C10.1 71.6,23.9 71.2,24.3 L2.1 | X1.1 79.41,15.89 73.6,21.7 73.6,23.23 72.72,24.1
N$29
  Top 0.3: IC2.9 76.75,27.75 78,26.5 78,24.25 R5.1
N$30
  Top 0.3: IC2.10 77.25,28.25 78.5,27 78.5,25.75 R6.2
N$31
  Top 0.3: R5.2 81.56,22.81 X1.16
N$32
  Top 0.3: R6.1 81.76,24.19 X1.4
N$33
  Top 0.3: IC2.13 78.8,29.75 R7.1
N$34
  Top 0.3: IC2.14 77.75,30.25 79.65,32.15 R9.2
N$35
  Top 0.3: R11.2 81.71,26.96 X1.5
N$36
  Top 0.3: R13.1 81.6,28.35 X1.18
N$37
  Top 0.3: IC2.17 75.85,34.8 R8.1
N$38
  Top 0.3: IC2.18 75.35,36.3 R10.2
N$39
  Top 0.3: R7.2 81.87,31.12 X1.19
N$40
  Top 0.3: R9.1 81.45,32.5 X1.7
N$41
  Top 0.3: R12.2 82.02,35.27 X1.8
N$42
  Top 0.3: R14.1 81.4,36.65 X1.21
N$43
  Top 0.3: IC2.15 77.25,30.75 78.5,32 78.5,33.45 R12.1
N$44
  Top 0.3: IC2.16 76.75,31.25 78,32.5 78,34.95 R14.2
N$45
  Top 0.3: IC2.12 79,29.25 R13.2
N$46
  Top 0.3: IC2.11 77.75,28.75 79.65,26.85 R11.1
N$47
  Top 0.3: R8.2 82.17,39.42 X1.22
N$48
  Top 0.3: R10.1 81.56,40.81 X1.10
N$49
  Top 0.3: IC2.8 75.85,24.4 R4.2
N$50
  Top 0.3: IC2.7 75.35,22.9 R3.1
N$51
  Top 0.3: X3.2 36.1,15.76 R2.2
N$52
  Top 0.3: X3.3 36.5,14.16 36.5,15.4 37.6,16.5 R15.2
N$53
  Top 0.3: IC3.7 58.27,49.78 R16.2 58.2,50.15 58.2,56.4 58.82,57.02 60.21,57.02 CAN.3
N$54
  Top 0.3: CAN.2 59.5,50.25 R16.1 59.53,49.78 IC3.6
N$55  (via drill 0.3)
  Top 0.3: IC1.34 v37,35.5 | IC2.27 69.75,30.25 69.3,30.7 v69.3,31.3
  Bottom 0.3: v69.3,31.3 68.4,31.3 63.7,36 38.5,36 38.3,36.2 37.7,36.2 v37,35.5
N$56
  Top 0.3: SPI.5 22.08,49.53 R24.1
N$57
  Top 0.3: SPI.4 19.54,49.49 R25.1
N$58
  Top 0.3: SPI.3 R23.1
N$59
  Top 0.3: SPI.2 14.46,49.49 R22.1
N$60
  Top 0.3: UART.3 52.04,49.49 R21.1
N$61
  Top 0.3: UART.2 R20.1
N$62
  Top 0.3: I2C.3 32.04,49.49 R19.1
N$63
  Top 0.3: I2C.2 R18.1
N$64
  Top 0.3: PPM.3 42.04,49.49 R17.1
N$65  (via drill 0.3)
  Top 0.3: IC1.33 37.5,36 v38,35.5 | IC2.1 70.6,27.1 v70.5,27
  Bottom 0.3: v38,35.5 63.4,35.5 68.3,30.6 69.5,30.6 70.5,29.6 v70.5,27
N$66  (via drill 0.3)
  Top 0.3: IC1.35 36.5,36 v36,35.5 | IC2.31 69.25,28.25 v69,28
  Bottom 0.3: v36,35.5 36.7,34.8 63.2,34.8 69,29 v69,28
N$67  (via drill 0.3)
  Top 0.3: IC1.64 29.1,29 v29.4,29.3
  Bottom 0.3: DISPLAY1.28 15.32,30.8 25.3,30.8 26.8,29.3 v29.4,29.3
N$68  (via drill 0.3)
  Top 0.3: IC1.63 28.6,29.5 v29.4,30.3
  Bottom 0.3: DISPLAY1.36 7.5,48.78 7.5,39.6 15.7,31.4 25.6,31.4 26.7,30.3 v29.4,30.3
N$69  (via drill 0.3)
  Top 0.3: IC1.36 36,39 v39,42 | v76.5,46 76.84,46.34 X1.12
  Bottom 0.3: v39,42 72.5,42 v76.5,46
N$70
  Top 0.3: R35.2 V+.1@1 V+.1@2
N$71
  pour Top (no thermals): 65.4,21.2 65.4,23.5 69,23.5 70.5,22 71.5,22 72,21.5 72,2.5 68,2.5 68,18.6
N$72
  Top 0.3: IC1.21 IC1.22 44.33,34 C27.1 C26.1 47.88,34.08 L4.1
N$73
  Top 0.5: L1.1 C24.1 58.52,31.7 61.17,31.7 C23.1 | C23.1 61.8,30.12 IC6.4 | C23.1 63.65,30.6 R34.2
N$74
  Top 0.3: R30.SA 66.1,24.55 R32.1
N$75
  Top 0.3: C22.1 54.48,26.12 R33.1 54.89,25.76 59.46,25.76 60.06,26.36 IC6.2 65.22,26.36 R32.2
N$76
  Top 0.3: R30.SB 64,24.45 R31.1
N$77
  Top 0.3: R41.2 R34.1 R31.2 63.62,27.64 IC6.3
N$78
  pour Top: 73.1,43.66 73.8,43.46 75.92,44.98 75.92,45.36 74.8,45.66 74.76,46.82 74.54,46.86 74.5,48.18 75.3,48.7 75.04,58.14 73.74,58.34 70.6,56.94 70.64,56.06 70.72,56.06 69.86,53.48 69.9,53.18 69.72,53.1 69.8,52.88 69.86,52.6 69.9,52.4 69.9,52.16 69.76,52.3 69.56,52.38 69.42,52.44 69.3,52.46 68.96,52.14 68.74,51.88 68.62,51.68 68.58,51.54 68.58,51.36 68.7,51.28 68.9,51.22 69.16,51.2 69.54,51.22 69.84,51.34 69.98,51.5 70.04,51.78 70.08,51.48 70.16,51.26 70.44,51.24 70.96,50.04 70.98,49.58 71.08,49.4 71.48,49.32 71.46,49.14 71.82,49.08 73.04,49.8 73.04,50.08 73.82,50.52 73.84,49.84 73.7,49.84 73.26,49.54 73.34,46.54 73.14,46.38 73.24,45 72.92,44.74 72.98,44.4 73.04,44.06
PPM
  Top 0.3: IC1.37 35.5,41.25 R17.2
SPI1_MISO  (via drill 0.3)
  Top 0.3: IC1.31 v38.5,39.5 | DISPLAY1.26 3.95,38.85 2.7,40.1 1.7,40.1 1,40.8 1,42.1 1.6,42.7 3.5,42.7 DISPLAY1.30 8.67,43.93 v8.7,43.9 | IC2.30 69.25,28.75 68.5,29.5 v68.5,35
  Bottom 0.3: v8.7,43.9 34.1,43.9 v38.5,39.5 38.5,38.8 40.1,37.2 64.3,37.2 66.5,35 v68.5,35 69.47,35 X1.13
SPI1_MOSI  (via drill 0.3)
  Top 0.3: IC1.32 38,38.8 v37.8,39 | DISPLAY1.34 8.79,49.01 9.6,48.2 v9.6,42.9 | IC2.32 70.25,27.75 69.5,27 68.5,27 68,27.5 68,33.5 v67.5,34
  Bottom 0.3: DISPLAY1.22 6,35.04 6,36.9 5.4,37.5 4.2,37.5 3.5,38.2 3.5,47.78 DISPLAY1.34 | v9.6,42.9 33.9,42.9 v37.8,39 37.8,38.7 39.9,36.6 64,36.6 66.6,34 v67.5,34 70.5,34 81.5,45 86.38,45 X1.24
SPI1_SCK  (via drill 0.3)
  Top 0.3: IC2.2 72.85,26.45 72.7,26.3 68.2,26.3 67.5,27 67.5,31 66.5,32 v66.5,36 | IC1.30 39,38.8 v39.2,39 | v6,47.74 8.66,47.74 v8.7,47.7
  Bottom 0.3: DISPLAY1.18 3.42,30 1.4,30 1,30.4 1,49.6 1.7,50.3 5.1,50.3 6,49.4 v6,47.74 DISPLAY1.32 | v8.7,47.7 32,47.7 39.2,40.5 v39.2,39 40.4,37.8 64.7,37.8 v66.5,36 68.4,36 83,50.6 84.2,50.6 86.42,48.38 X1.25
SPI2_MISO
  Top 0.3: IC1.53 21,34.5 19.5,36 R25.2
SPI2_MOSI
  Top 0.3: IC1.54 20.7,34 17,37.7 R23.2
SPI2_NSS
  Top 0.3: IC1.51 22.9,35.5 22,36.4 R24.2
SPI2_SCK
  Top 0.3: IC1.52 21.7,35 20.8,35.9 20.8,48.1 20.3,48.6 15.35,48.6 R22.2
SWCLK
  Top 0.3: SWD.2 24.27,21.77 24.9,22.4 28.9,22.4 29,22.3 IC1.76
SWDIO
  Top 0.3: SWD.4 23.69,25 IC1.72
USB+  (via drill 0.3)
  Top 0.3: R15.1 v37.6,19.7 | v32,25.3 29.7,25.3 29.5,25.5 IC1.71
  Bottom 0.3: v37.6,19.7 v32,25.3
USB-  (via drill 0.3)
  Top 0.3: R2.1 v36.1,19.7 | v30,26 IC1.70
  Bottom 0.3: v36.1,19.7 36.1,19.9 v30,26

### Text on the board
tPlace: Teststand / V1 01/19 | github.com/jankae/Teststand | GND | TX | DIO | GND | CLK | 3V3
tNames: GND | SCK | MOSI | MISO | NSS | GND | SCL | SDA | GND | 5V | PPM | GND | TX | RX | GND | L | H